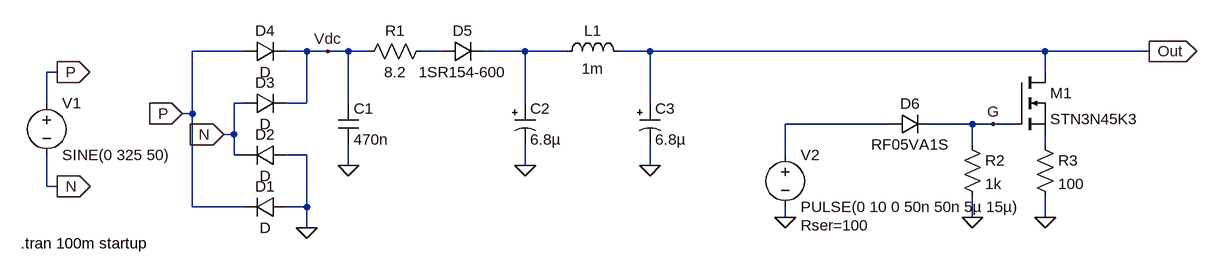
[diagram p0: schematic Filtrage TNY.asc]
Filtrage TNY.asc, the LTspice schematic file:
Version 4
SHEET 1 1748 680
WIRE 256 32 176 32
WIRE 352 32 320 32
WIRE 384 32 352 32
WIRE 416 32 384 32
WIRE 448 32 416 32
WIRE 560 32 528 32
WIRE 688 32 624 32
WIRE 752 32 688 32
WIRE 880 32 832 32
WIRE 1488 32 880 32
WIRE 1648 32 1488 32
WIRE -32 64 -48 64
WIRE 1488 64 1488 32
WIRE -48 112 -48 64
WIRE 256 112 240 112
WIRE 352 112 352 32
WIRE 352 112 320 112
WIRE 416 112 416 32
WIRE 688 112 688 32
WIRE 880 112 880 32
WIRE 176 128 176 32
WIRE 176 128 160 128
WIRE 1248 144 1088 144
WIRE 1376 144 1312 144
WIRE 1408 144 1376 144
WIRE 1440 144 1408 144
WIRE 240 160 240 112
WIRE 240 160 224 160
WIRE 1376 176 1376 144
WIRE 1488 176 1488 160
WIRE 240 192 240 160
WIRE 256 192 240 192
WIRE 352 192 320 192
WIRE 1088 192 1088 144
WIRE 416 208 416 176
WIRE 688 208 688 176
WIRE 880 208 880 176
WIRE -48 240 -48 192
WIRE -32 240 -48 240
WIRE 176 272 176 128
WIRE 256 272 176 272
WIRE 352 272 352 192
WIRE 352 272 320 272
WIRE 1088 288 1088 272
WIRE 1376 288 1376 256
WIRE 1488 288 1488 256
WIRE 352 304 352 272
FLAG -32 240 N
IOPIN -32 240 Out
FLAG -32 64 P
IOPIN -32 64 Out
FLAG 224 160 N
IOPIN 224 160 In
FLAG 160 128 P
IOPIN 160 128 In
FLAG 352 304 0
FLAG 416 208 0
FLAG 384 32 Vdc
FLAG 688 208 0
FLAG 880 208 0
FLAG 1648 32 Out
IOPIN 1648 32 Out
FLAG 1088 288 0
FLAG 1488 288 0
FLAG 1376 288 0
FLAG 1408 144 G
SYMBOL voltage -48 96 R0
WINDOW 123 0 0 Left 0
WINDOW 39 24 124 Left 2
SYMATTR InstName V1
SYMATTR Value SINE(0 325 50)
SYMBOL diode 320 256 R90
WINDOW 0 0 32 VBottom 2
WINDOW 3 32 32 VTop 2
SYMATTR InstName D1
SYMBOL diode 320 176 R90
WINDOW 0 0 32 VBottom 2
WINDOW 3 32 32 VTop 2
SYMATTR InstName D2
SYMBOL diode 256 128 R270
WINDOW 0 32 32 VTop 2
WINDOW 3 0 32 VBottom 2
SYMATTR InstName D3
SYMBOL diode 256 48 R270
WINDOW 0 32 32 VTop 2
WINDOW 3 0 32 VBottom 2
SYMATTR InstName D4
SYMBOL cap 400 112 R0
SYMATTR InstName C1
SYMATTR Value 470n
SYMBOL res 432 48 R270
WINDOW 0 32 56 VTop 2
WINDOW 3 0 56 VBottom 2
SYMATTR InstName R1
SYMATTR Value 8.2
SYMBOL diode 560 48 R270
WINDOW 0 32 32 VTop 2
WINDOW 3 0 32 VBottom 2
SYMATTR InstName D5
SYMATTR Value 1SR154-600
SYMBOL polcap 672 112 R0
WINDOW 3 24 56 Left 2
SYMATTR Value 6.8µ
SYMATTR InstName C2
SYMATTR Description Capacitor
SYMATTR Type cap
SYMATTR SpiceLine V=63 Irms=1.73205 Rser=0.075 Lser=0
SYMBOL polcap 864 112 R0
WINDOW 3 24 56 Left 2
SYMATTR Value 6.8µ
SYMATTR InstName C3
SYMATTR Description Capacitor
SYMATTR Type cap
SYMATTR SpiceLine V=63 Irms=500m Rser=0.17 Lser=0
SYMBOL ind 736 48 R270
WINDOW 0 32 56 VTop 2
WINDOW 3 5 56 VBottom 2
SYMATTR InstName L1
SYMATTR Value 1m
SYMBOL voltage 1088 176 R0
WINDOW 123 0 0 Left 0
WINDOW 39 24 124 Left 2
SYMATTR SpiceLine Rser=100
SYMATTR InstName V2
SYMATTR Value PULSE(0 10 0 50n 50n 5µ 15µ)
SYMBOL nmos 1440 64 R0
SYMATTR InstName M1
SYMATTR Value STN3N45K3
SYMBOL res 1360 160 R0
SYMATTR InstName R2
SYMATTR Value 1k
SYMBOL diode 1248 160 R270
WINDOW 0 32 32 VTop 2
WINDOW 3 0 32 VBottom 2
SYMATTR InstName D6
SYMATTR Value RF05VA1S
SYMBOL res 1472 160 R0
SYMATTR InstName R3
SYMATTR Value 100
TEXT -88 328 Left 2 !.tran 100m startup

The netlist it stands for:
* Filtrage TNY.asc
V1 P N SINE(0 325 50)
D1 0 P D
D2 0 N D
D3 N Vdc D
D4 P Vdc D
C1 Vdc 0 470n
R1 Vdc N001 8.2
D5 N001 N002 1SR154-600
C2 N002 0 6.8µ V=63 Irms=1.73205 Rser=0.075 Lser=0
C3 Out 0 6.8µ V=63 Irms=500m Rser=0.17 Lser=0
L1 N002 Out 1m
V2 N003 0 PULSE(0 10 0 50n 50n 5µ 15µ) Rser=100
M1 Out G N004 N004 STN3N45K3
R2 G 0 1k
D6 N003 G RF05VA1S
R3 N004 0 100
.model D D
.lib standard.dio
.model NMOS NMOS
.model PMOS PMOS
.lib standard.mos
.tran 100m startup
.backanno
.end